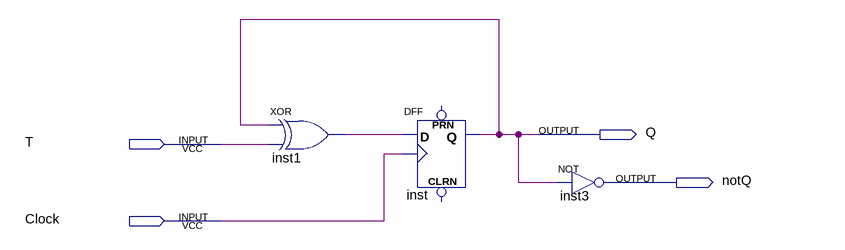
[diagram p0: schematic sheet]
// Quartus schematic TffEN.bdf as structural Verilog: 3 symbols, 4 pins
module TffEN (
  input  T,
  input  Clock,
  output Q,
  output notQ
);

  wire inst1_out;

  xor inst1 (inst1_out, Q, T);
  DFF inst (.CLK(Clock), .D(inst1_out), .Q(Q));  // open: CLRN, PRN
  not inst3 (notQ, Q);
endmodule
